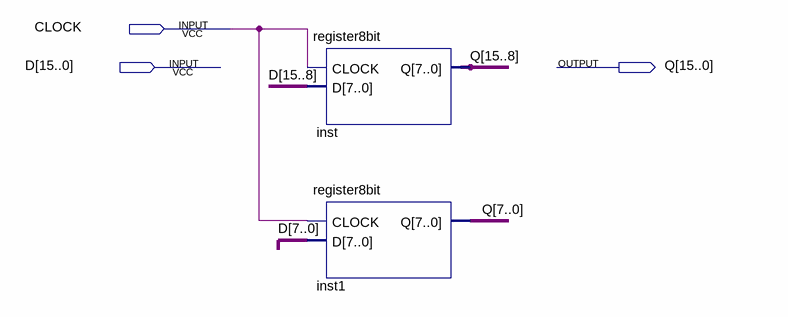
[diagram p0: schematic sheet]
// Quartus schematic Register16bit.bdf as structural Verilog: 2 symbols, 3 pins
module Register16bit (
  input  CLOCK,
  input  [15:0] D,
  output [15:0] Q
);

  register8bit inst (.CLOCK(CLOCK), .D(D[15:8]), .Q(Q[15:8]));
  register8bit inst1 (.CLOCK(CLOCK), .D(D[7:0]), .Q(Q[7:0]));
endmodule
